# Altium schematic sheet Nixie_Clock.SchDoc
size A3
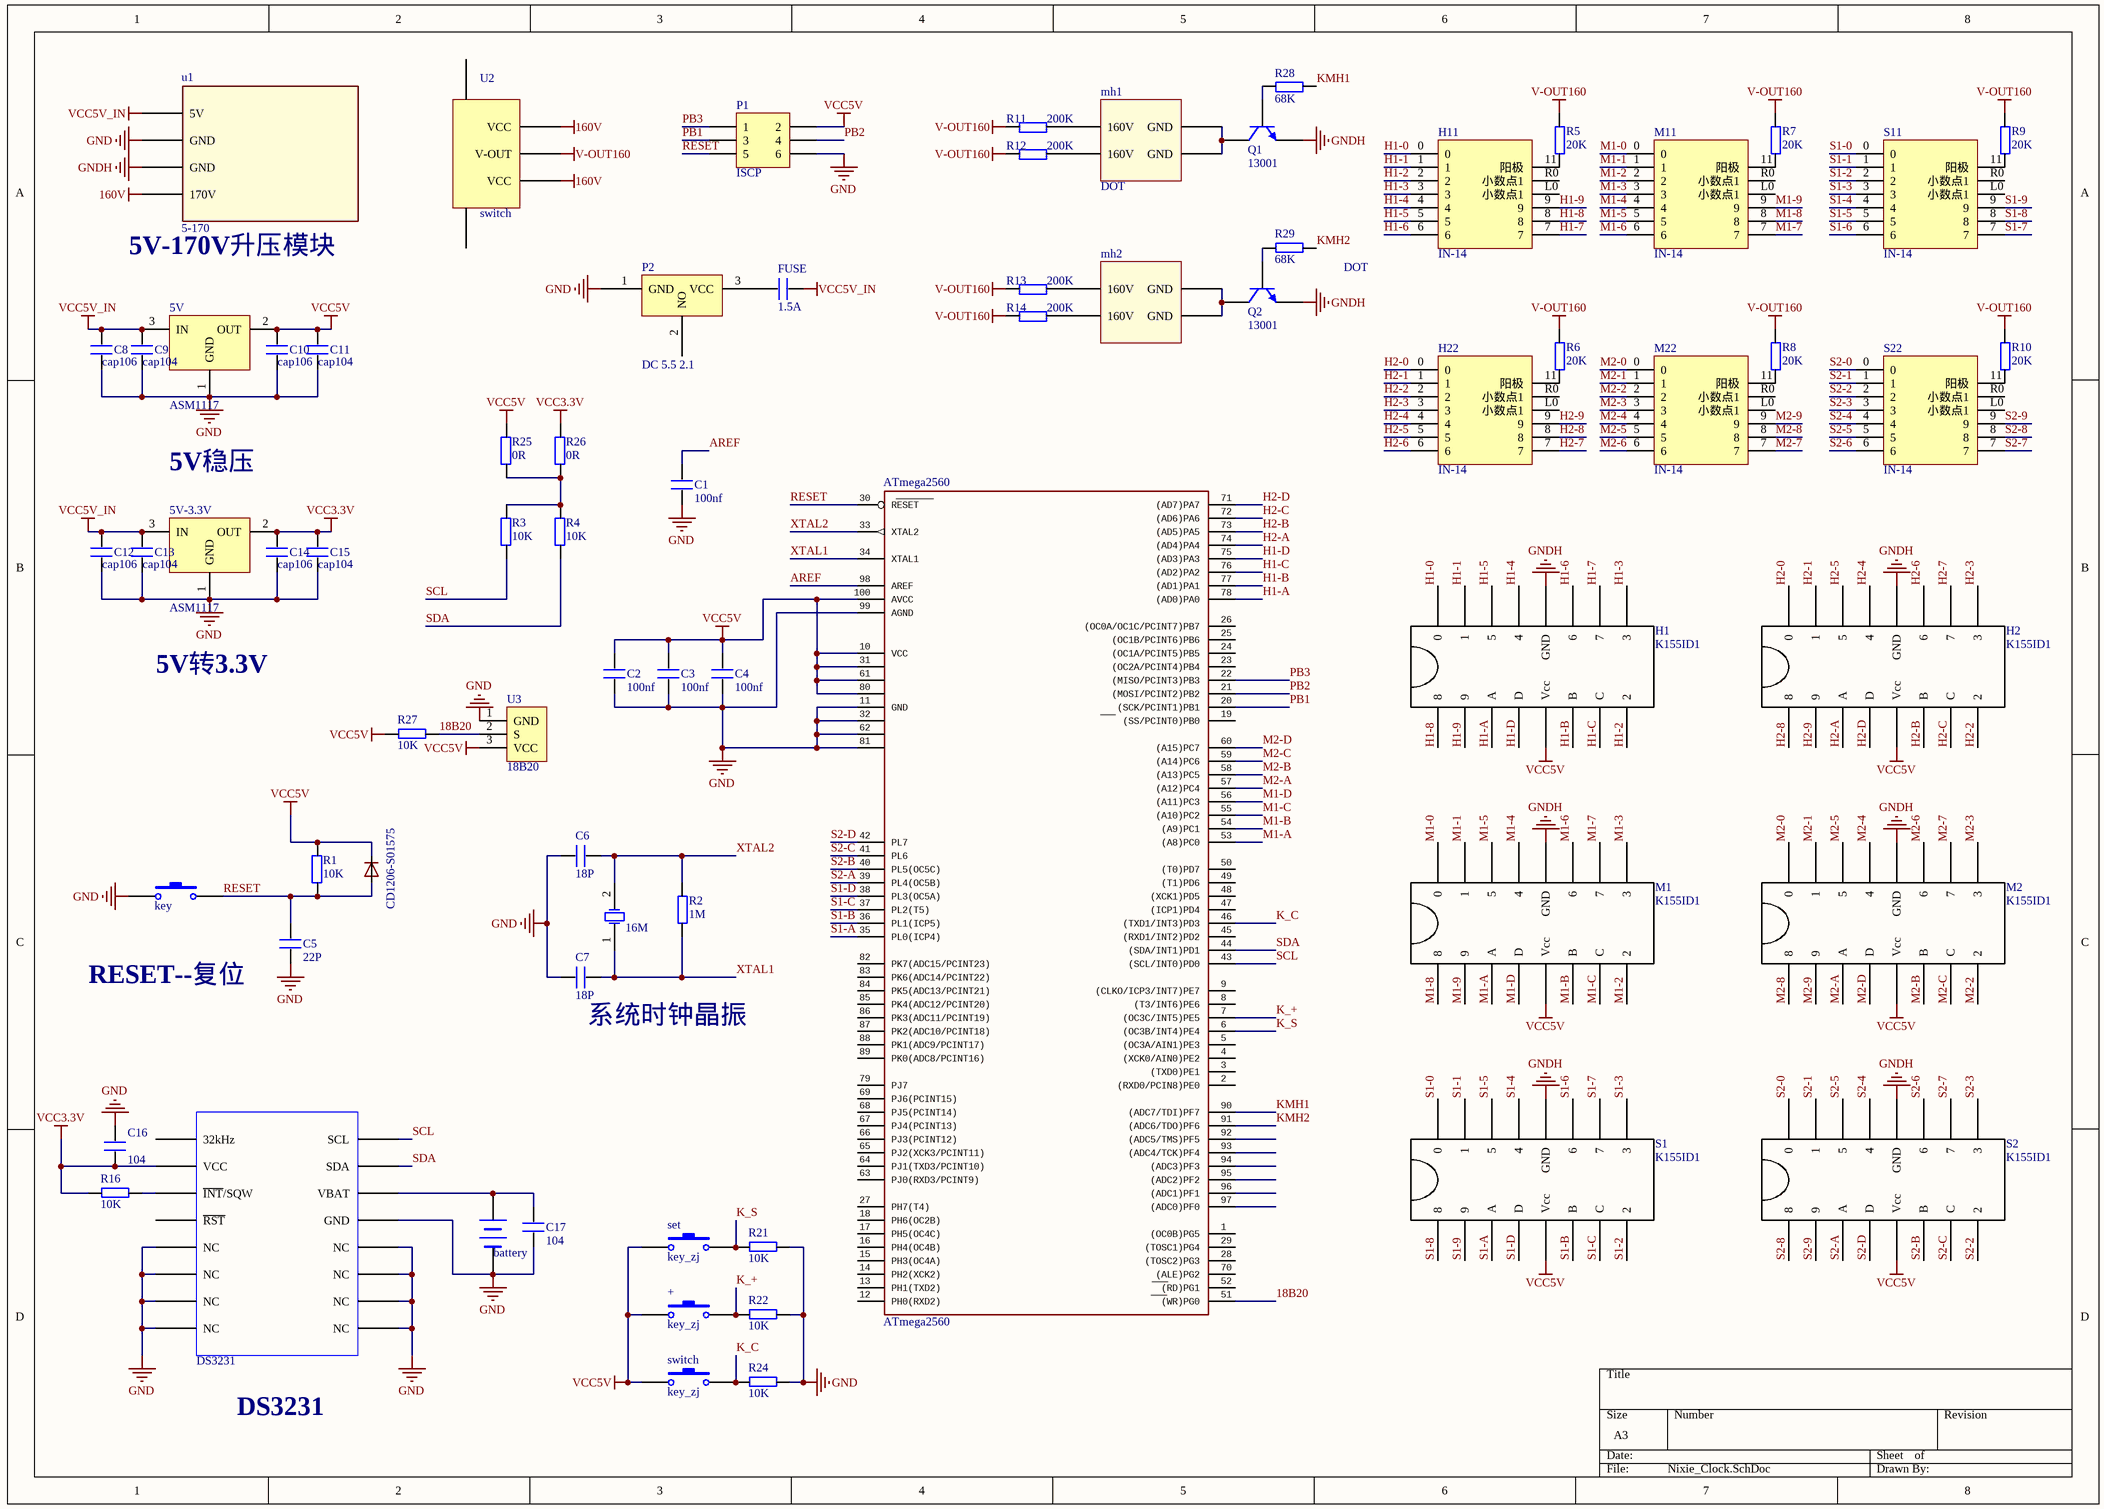
[diagram p0: Nixie_Clock.SchDoc]

## Parts
5V  ASM1117  [AMS1117]
5V-3.3V  ASM1117  [AMS1117]
+  key_zj  [key_zj]
ATmega2560  ATmega2560  [ATmega2560]
bat  battery  [battery]
C1  100nf  [0805_cap]
C2  100nf  [0805_cap]
C3  100nf  [0805_cap]
C4  100nf  [0805_cap]
C5  22P  [0805_cap]
C6  18P  [0805_cap]
C7  18P  [0805_cap]
C8  cap106  [1210_cap]
C9  cap104  [0805_cap]
C10  cap106  [1210_cap]
C11  cap104  [0805_cap]
C12  cap106  [1210_cap]
C13  cap104  [0805_cap]
C14  cap106  [1210_cap]
C15  cap104  [0805_cap]
C16  104  [0805_cap]
C17  104  [0805_cap]
DIODE  CD1206-S01575  [DIODE]
ds3231  DS3231  [DS3231]
FUSE  1.5A  [1210_cap]
H1  K155ID1  [DIP-16]
H2  K155ID1  [DIP-16]
H11  IN-14  [IN-14]
H22  IN-14  [IN-14]
key  key  [key]
M1  K155ID1  [DIP-16]
M2  K155ID1  [DIP-16]
M11  IN-14  [IN-14]
M22  IN-14  [IN-14]
mh1  DOT  [dot]
mh2  DOT  [dot]
P1  ISCP  [HDR2X3]
P2  DC 5.5 2.1  [DC 5.5 2.1]
Q1  13001  [13001]
Q2  13001  [13001]
R1  10K  [0805_res]
R2  1M  [0805_res]
R3  10K  [0805_res]
R4  10K  [0805_res]
R5  20K  [0805_res]
R6  20K  [0805_res]
R7  20K  [0805_res]
R8  20K  [0805_res]
R9  20K  [0805_res]
R10  20K  [0805_res]
R11  200K  [0805_res]
R12  200K  [0805_res]
R13  200K  [0805_res]
R14  200K  [0805_res]
R16  10K  [0805_res]
R21  10K  [0805_res]
R22  10K  [0805_res]
R24  10K  [0805_res]
R25  0R  [0805_res]
R26  0R  [0805_res]
R27  10K  [0805_res]
R28  68K  [0805_res]
R29  68K  [0805_res]
S1  K155ID1  [DIP-16]
S2  K155ID1  [DIP-16]
S11  IN-14  [IN-14]
S22  IN-14  [IN-14]
set  key_zj  [key_zj]
switch  key_zj  [key_zj]
u1  5-170  [5-170V]
U2  switch  [switch]
U3  18B20  [18B20]
Y1  16M  [XTAL]

## Nets
160V: u1.4(170V) U2.1(VCC) U2.3(VCC)
GND: 5V.1(GND) 5V-3.3V.1(GND) ATmega2560.11(GND) ATmega2560.32(GND1) ATmega2560.62(GND2) ATmega2560.81(GND3) ATmega2560.99(AGND) bat.2(-) C1.1 C2.1 C3.1 C4.1 C5.1 C6.2 C7.2 C8.1 C9.1 C10.1 C11.1 C12.1 C13.1 C14.1 C15.1 C16.2 C17.2 ds3231.5(NC) ds3231.6(NC) ds3231.7(NC) ds3231.8(NC) ds3231.9(NC) ds3231.10(NC) ds3231.11(NC) ds3231.12(NC) ds3231.13(GND) key.1 P1.6 P2.1(GND) R21.1 R22.1 R24.1 u1.2(GND) U3.1(GND)
GNDH: H1.12(GND) H2.12(GND) M1.12(GND) M2.12(GND) Q1.1(E) Q2.1(E) S1.12(GND) S2.12(GND) u1.3(GND)
V-OUT160: R5.2 R6.2 R7.2 R8.2 R9.2 R10.2 R11.1 R12.1 R13.1 R14.1 U2.2(V-OUT)
VCC3.3V: 5V-3.3V.2(OUT) C14.2 C15.2 C16.1 ds3231.2(VCC) R16.2 R26.1
VCC5V: 5V.2(OUT) +.1 ATmega2560.10(VCC) ATmega2560.31(VCC1) ATmega2560.61(VCC2) ATmega2560.80(VCC3) ATmega2560.100(AVCC) C2.2 C3.2 C4.2 C10.2 C11.2 DIODE.C H1.5(Vcc) H2.5(Vcc) M1.5(Vcc) M2.5(Vcc) P1.2 R1.1 R25.1 R27.2 S1.5(Vcc) S2.5(Vcc) set.1 switch.1 U3.3(VCC)
VCC5V_IN: 5V.3(IN) 5V-3.3V.3(IN) C8.2 C9.2 C12.2 C13.2 FUSE.2 u1.1(5V)
18B20: ATmega2560.51((WR)PG0) R27.1 U3.2(S)
AREF: ATmega2560.98(AREF) C1.2
H1-0: H1.16(0) H11.0
H1-1: H1.15(1) H11.1
H1-2: H1.8(2) H11.2
H1-3: H1.9(3) H11.3
H1-4: H1.13(4) H11.4
H1-5: H1.14(5) H11.5
H1-6: H1.11(6) H11.6
H1-7: H1.10(7) H11.7
H1-8: H1.1(8) H11.8
H1-9: H1.2(9) H11.9
H1-A: ATmega2560.78((AD0)PA0) H1.3(A)
H1-B: ATmega2560.77((AD1)PA1) H1.6(B)
H1-C: ATmega2560.76((AD2)PA2) H1.7(C)
H1-D: ATmega2560.75((AD3)PA3) H1.4(D)
H2-0: H2.16(0) H22.0
H2-1: H2.15(1) H22.1
H2-2: H2.8(2) H22.2
H2-3: H2.9(3) H22.3
H2-4: H2.13(4) H22.4
H2-5: H2.14(5) H22.5
H2-6: H2.11(6) H22.6
H2-7: H2.10(7) H22.7
H2-8: H2.1(8) H22.8
H2-9: H2.2(9) H22.9
H2-A: ATmega2560.74((AD4)PA4) H2.3(A)
H2-B: ATmega2560.73((AD5)PA5) H2.6(B)
H2-C: ATmega2560.72((AD6)PA6) H2.7(C)
H2-D: ATmega2560.71((AD7)PA7) H2.4(D)
K_+: +.2 ATmega2560.7((OC3C/INT5)PE5) R22.2
K_C: ATmega2560.46((TXD1/INT3)PD3) R24.2 switch.2
K_S: ATmega2560.6((OC3B/INT4)PE4) R21.2 set.2
KMH1: ATmega2560.90((ADC7/TDI)PF7) R28.2
KMH2: ATmega2560.91((ADC6/TDO)PF6) R29.1
M1-0: M1.16(0) M11.0
M1-1: M1.15(1) M11.1
M1-2: M1.8(2) M11.2
M1-3: M1.9(3) M11.3
M1-4: M1.13(4) M11.4
M1-5: M1.14(5) M11.5
M1-6: M1.11(6) M11.6
M1-7: M1.10(7) M11.7
M1-8: M1.1(8) M11.8
M1-9: M1.2(9) M11.9
M1-A: ATmega2560.53((A8)PC0) M1.3(A)
M1-B: ATmega2560.54((A9)PC1) M1.6(B)
M1-C: ATmega2560.55((A10)PC2) M1.7(C)
M1-D: ATmega2560.56((A11)PC3) M1.4(D)
M2-0: M2.16(0) M22.0
M2-1: M2.15(1) M22.1
M2-2: M2.8(2) M22.2
M2-3: M2.9(3) M22.3
M2-4: M2.13(4) M22.4
M2-5: M2.14(5) M22.5
M2-6: M2.11(6) M22.6
M2-7: M2.10(7) M22.7
M2-8: M2.1(8) M22.8
M2-9: M2.2(9) M22.9
M2-A: ATmega2560.57((A12)PC4) M2.3(A)
M2-B: ATmega2560.58((A13)PC5) M2.6(B)
M2-C: ATmega2560.59((A14)PC6) M2.7(C)
M2-D: ATmega2560.60((A15)PC7) M2.4(D)
PB1: ATmega2560.20((SCK/PCINT1)PB1) P1.3
PB2: ATmega2560.21((MOSI/PCINT2)PB2) P1.4
PB3: ATmega2560.22((MISO/PCINT3)PB3) P1.1
RESET: ATmega2560.30(RESET) C5.2 DIODE.A key.2 P1.5 R1.2
S1-0: S1.16(0) S11.0
S1-1: S1.15(1) S11.1
S1-2: S1.8(2) S11.2
S1-3: S1.9(3) S11.3
S1-4: S1.13(4) S11.4
S1-5: S1.14(5) S11.5
S1-6: S1.11(6) S11.6
S1-7: S1.10(7) S11.7
S1-8: S1.1(8) S11.8
S1-9: S1.2(9) S11.9
S1-A: ATmega2560.35(PL0(ICP4)) S1.3(A)
S1-B: ATmega2560.36(PL1(ICP5)) S1.6(B)
S1-C: ATmega2560.37(PL2(T5)) S1.7(C)
S1-D: ATmega2560.38(PL3(OC5A)) S1.4(D)
S2-0: S2.16(0) S22.0
S2-1: S2.15(1) S22.1
S2-2: S2.8(2) S22.2
S2-3: S2.9(3) S22.3
S2-4: S2.13(4) S22.4
S2-5: S2.14(5) S22.5
S2-6: S2.11(6) S22.6
S2-7: S2.10(7) S22.7
S2-8: S2.1(8) S22.8
S2-9: S2.2(9) S22.9
S2-A: ATmega2560.39(PL4(OC5B)) S2.3(A)
S2-B: ATmega2560.40(PL5(OC5C)) S2.6(B)
S2-C: ATmega2560.41(PL6) S2.7(C)
S2-D: ATmega2560.42(PL7) S2.4(D)
SCL: ATmega2560.43((SCL/INT0)PD0) ds3231.16(SCL) R3.2
SDA: ATmega2560.44((SDA/INT1)PD1) ds3231.15(SDA) R4.2
XTAL1: ATmega2560.34(XTAL1) C7.1 R2.1 Y1.1(OSC1)
XTAL2: ATmega2560.33(XTAL2) C6.1 R2.2 Y1.2(OSC2)
Netbat_1: bat.1(+) C17.1 ds3231.14(VBAT)
Netds3231_3: ds3231.3(~{INT}/SQW) R16.1
NetFUSE_1: FUSE.1 P2.3(VCC)
NetH11_11: H11.11(阳极) R5.1
NetH22_11: H22.11(阳极) R6.1
NetM11_11: M11.11(阳极) R7.1
NetM22_11: M22.11(阳极) R8.1
Netmh1_1: mh1.1(160V) R11.2
Netmh1_2: mh1.2(GND) mh1.4(GND) Q1.2(C)
Netmh1_3: mh1.3(160V) R12.2
Netmh2_1: mh2.1(160V) R13.2
Netmh2_2: mh2.2(GND) mh2.4(GND) Q2.2(C)
Netmh2_3: mh2.3(160V) R14.2
NetQ1_3: Q1.3(B) R28.1
NetQ2_3: Q2.3(B) R29.2
NetR3_1: R3.1 R4.1 R25.2 R26.2
NetR9_1: R9.1 S11.11(阳极)
NetR10_1: R10.1 S22.11(阳极)

Not connected (* = marked no-connect by the designer): ATmega2560 1((OC0B)PG5) 2((RXD0/PCIN8)PE0) 3((TXD0)PE1) 4((XCK0/AIN0)PE2) 5((OC3A/AIN1)PE3) 8((T3/INT6)PE6) 9((CLKO/ICP3/INT7)PE7) 12(PH0(RXD2)) 13(PH1(TXD2)) 14(PH2(XCK2)) 15(PH3(OC4A)) 16(PH4(OC4B)) 17(PH5(OC4C)) 18(PH6(OC2B)) 19((SS/PCINT0)PB0) 23((OC2A/PCINT4)PB4) 24((OC1A/PCINT5)PB5) 25((OC1B/PCINT6)PB6) 26((OC0A/OC1C/PCINT7)PB7) 27(PH7(T4)) 28((TOSC2)PG3) 29((TOSC1)PG4) 45((RXD1/INT2)PD2) 47((ICP1)PD4) 48((XCK1)PD5) 49((T1)PD6) 50((T0)PD7) 52((RD)PG1) 63(PJ0(RXD3/PCINT9)) 64(PJ1(TXD3/PCINT10)) 65(PJ2(XCK3/PCINT11)) 66(PJ3(PCINT12)) 67(PJ4(PCINT13)) 68(PJ5(PCINT14)) 69(PJ6(PCINT15)) 70((ALE)PG2) 79(PJ7) 82(PK7(ADC15/PCINT23)) 83(PK6(ADC14/PCINT22)) 84(PK5(ADC13/PCINT21)) 85(PK4(ADC12/PCINT20)) 86(PK3(ADC11/PCINT19)) 87(PK2(ADC10/PCINT18)) 88(PK1(ADC9/PCINT17)) 89(PK0(ADC8/PCINT16)) 92((ADC5/TMS)PF5) 93((ADC4/TCK)PF4) 94((ADC3)PF3) 95((ADC2)PF2) 96((ADC1)PF1) 97((ADC0)PF0); ds3231 1(32kHz) 4(~{RST}); H11 L0(小数点1) R0(小数点1); H22 L0(小数点1) R0(小数点1); M11 L0(小数点1) R0(小数点1); M22 L0(小数点1) R0(小数点1); P2 2(NO); S11 L0(小数点1) R0(小数点1); S22 L0(小数点1) R0(小数点1); U2 4 5

## Notes on the sheet
- (near u1) 5V-170V升压模块
- 5V稳压
- 5V转3.3V
- RESET--复位
- (near C7) 系统时钟晶振
- DS3231

## Library data of the parts
C1-C17 FUSE = cap
DIODE = DIODE
P1 = Header 3X2: Header, 3-Pin, Dual row; LatestRevisionDate: 17-Jul-2002; LatestRevisionNote: Re-released for DXP Platform.; Publisher: Altium Limited
R1-R14 R16 R21 R22 R24-R29 = 0805_res
Y1 = xtal